# EAGLE design Sensor_Plug_PCB (EAGLE 9.7.0)
Assembly variants: Standart
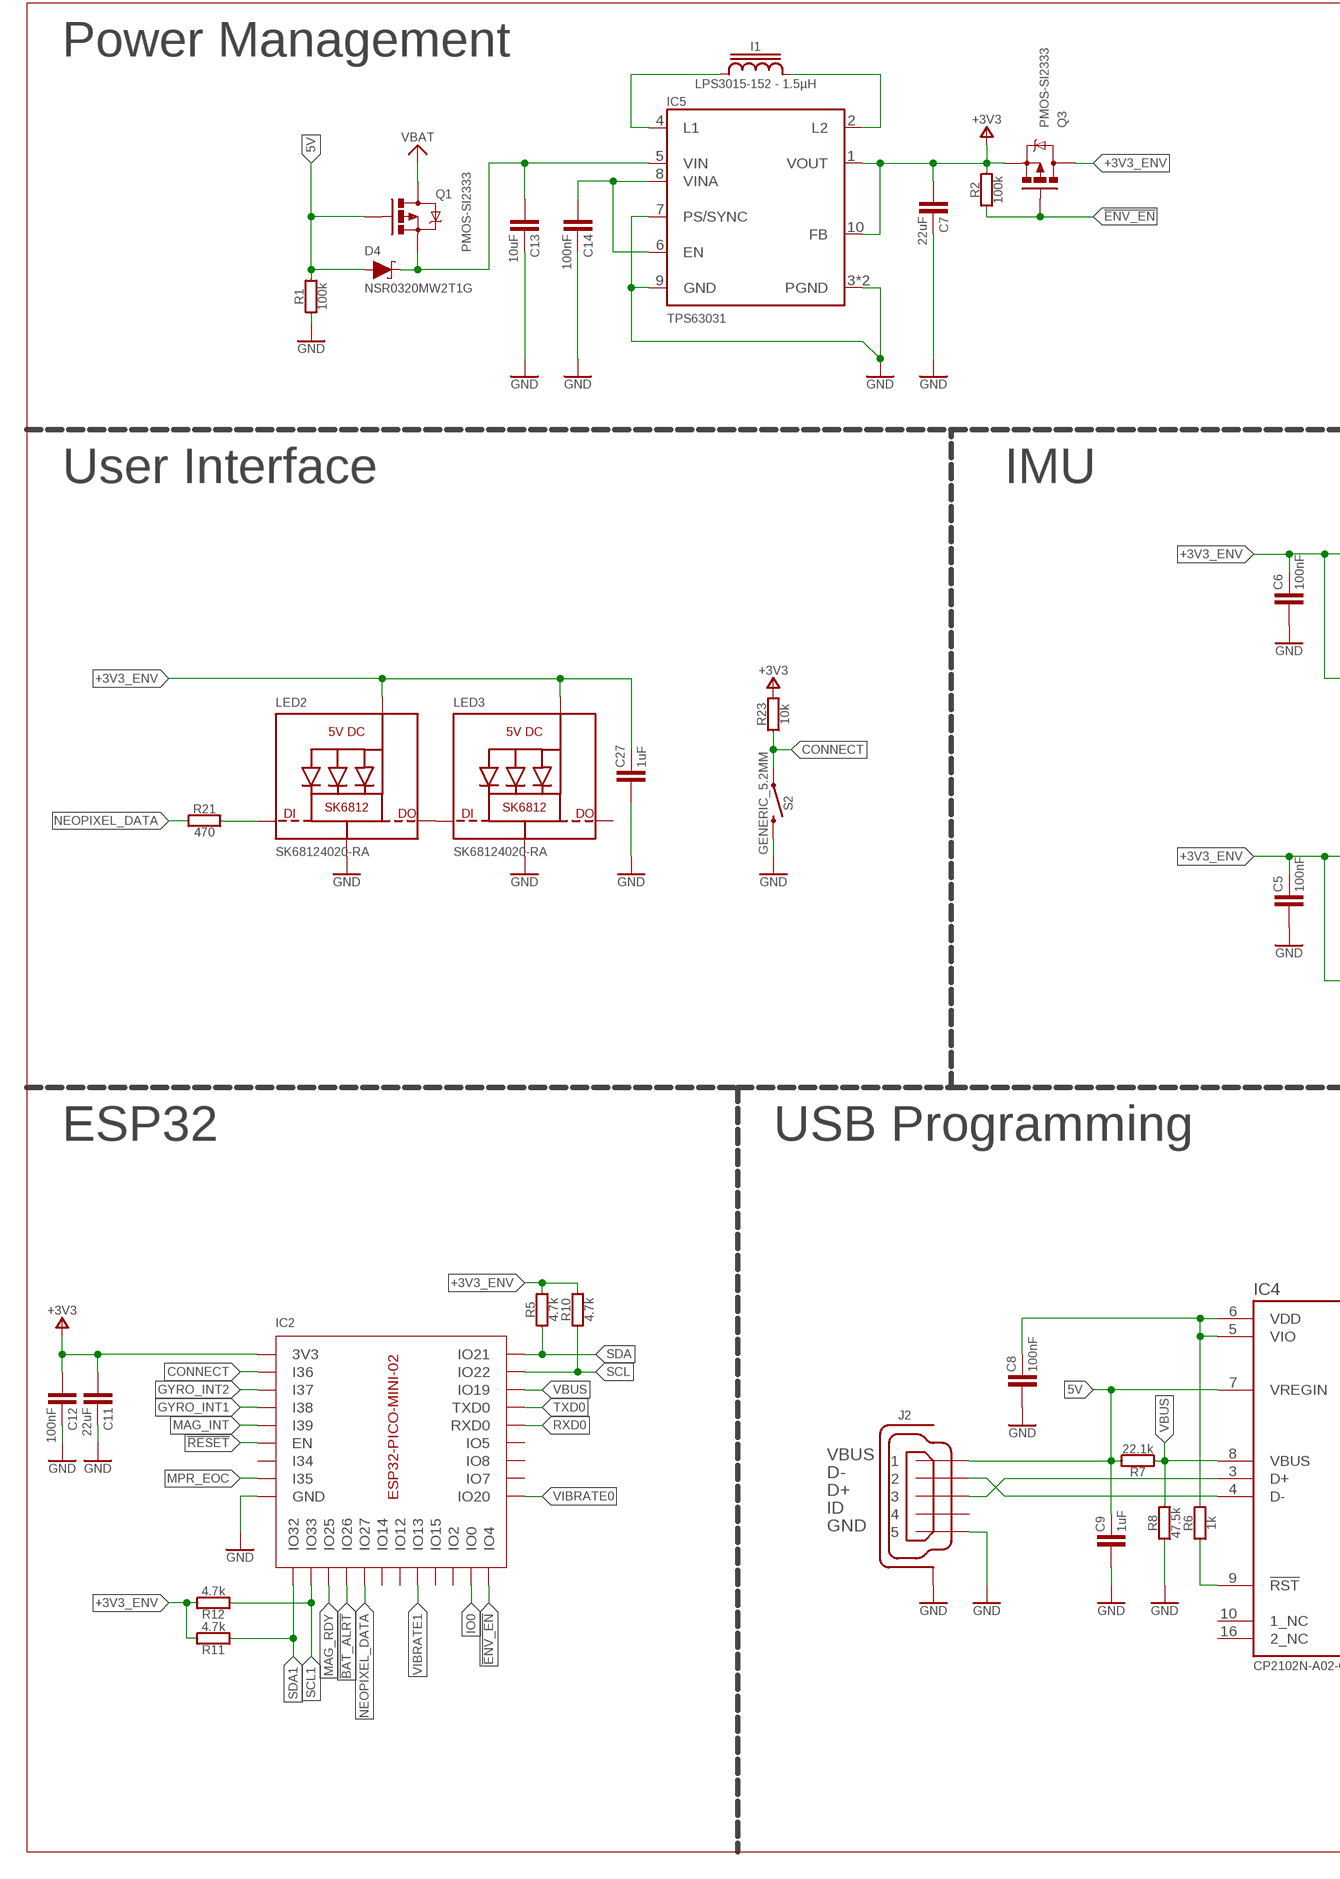
[diagram p0: schematic, sheet 1, part 1 of 2]
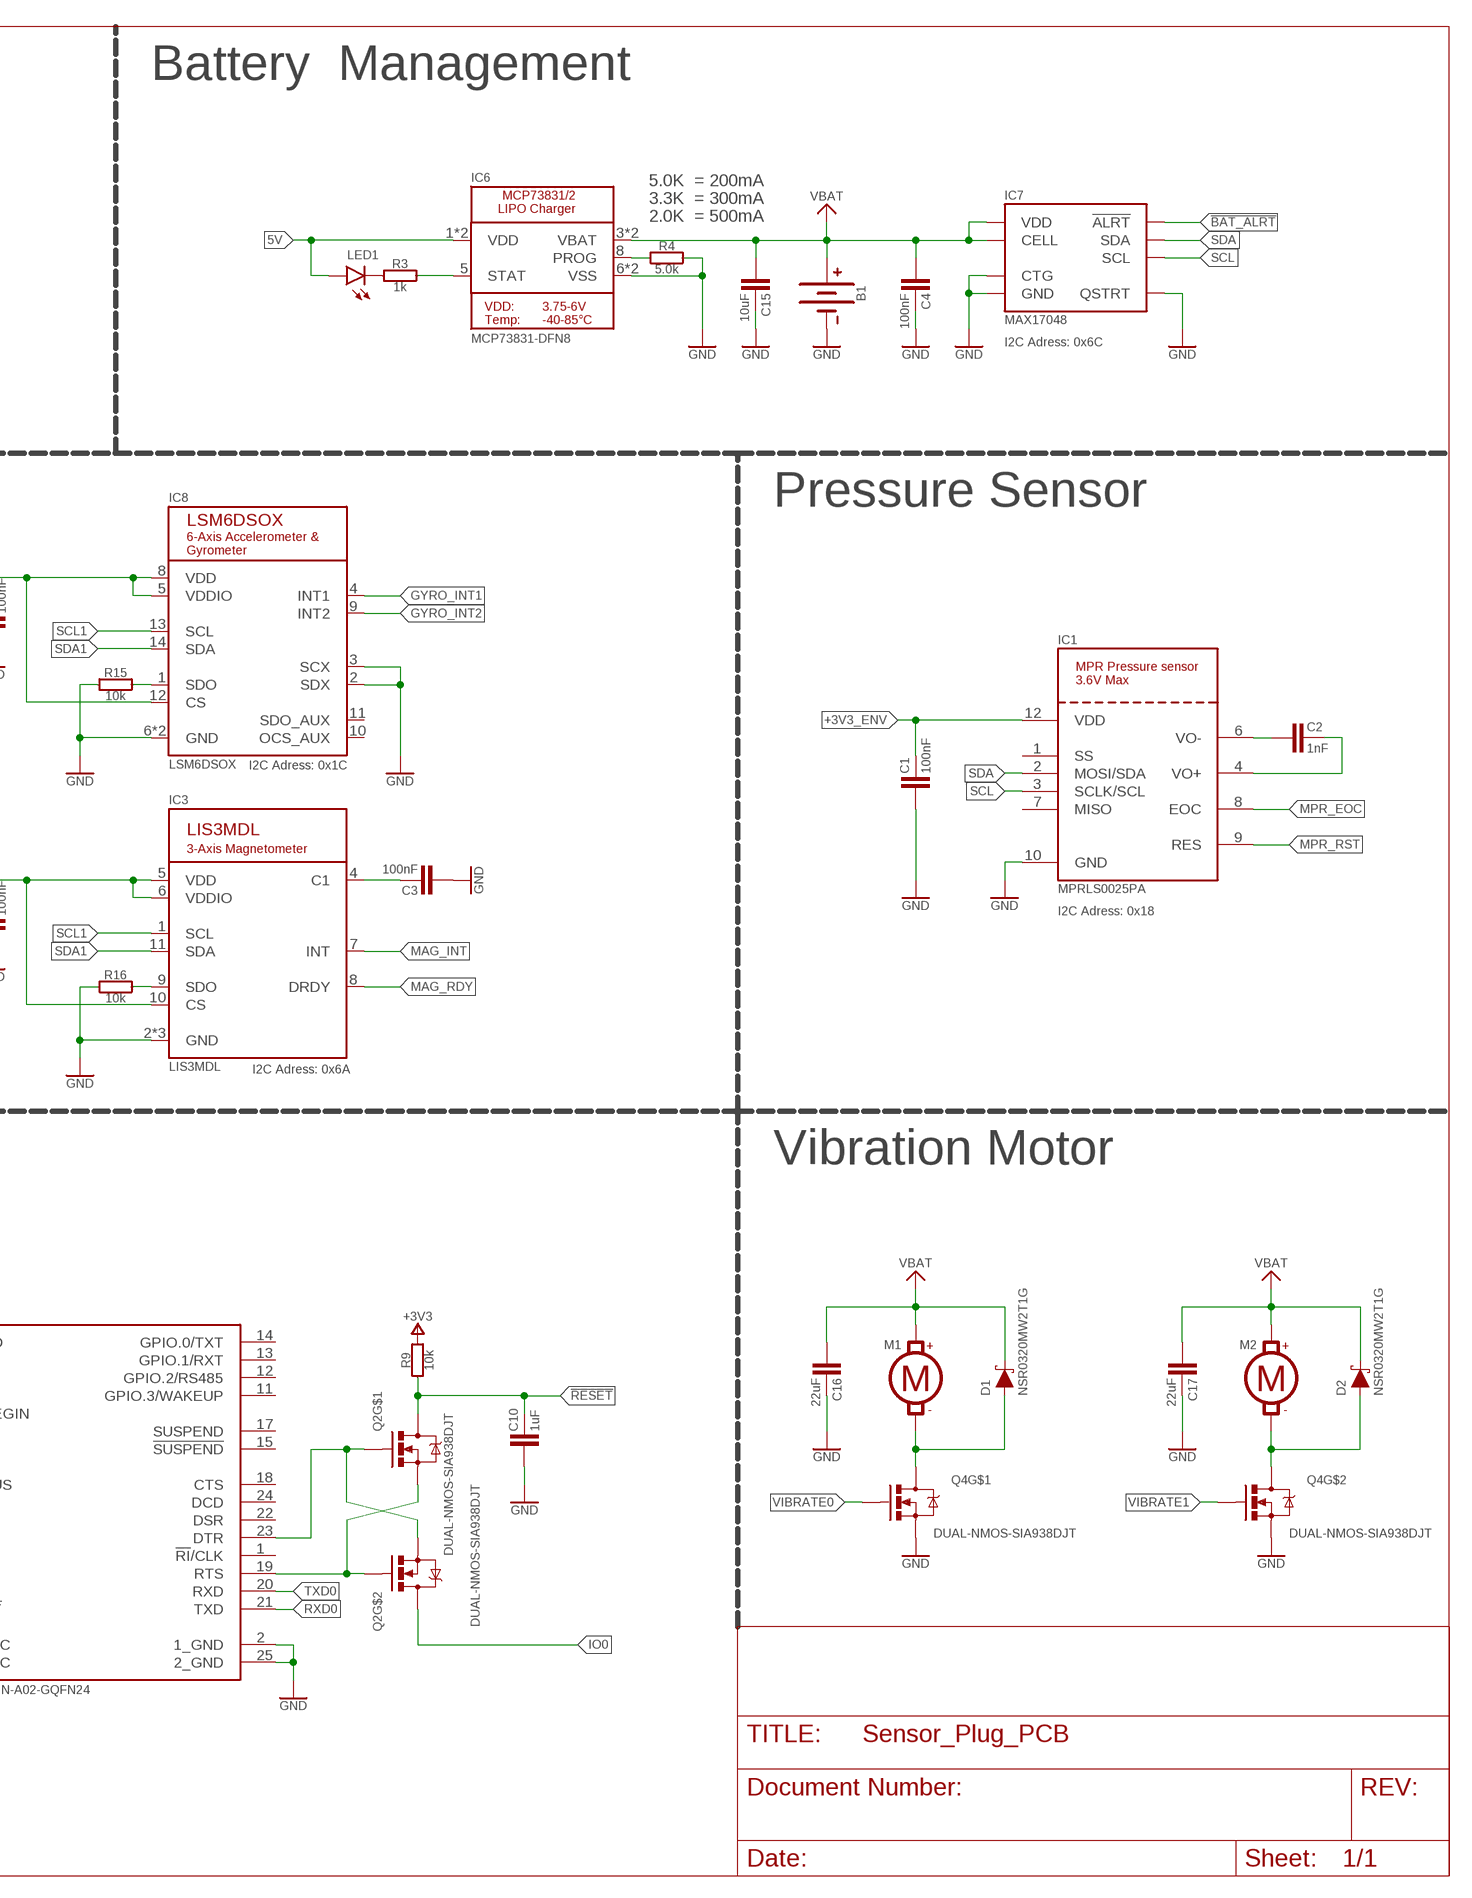
[diagram p1: schematic, sheet 1, part 2 of 2]

## Parts
B1  LIPO-JST_PH_SMDV-02  [JST_PH_SMDV-02]
C1  100nF  C-0603  [C0603]
C2  1nF  C-0603  [C0603]
C3  100nF  C-0603  [C0603]
C4  100nF  C-0603  [C0603]
C5  100nF  C-0603  [C0603]
C6  100nF  C-0603  [C0603]
C7  22uF  C-0805  [C0805]
C8  100nF  C-0603  [C0603]
C9  1uF  C-0603  [C0603]
C10  1uF  C-0603  [C0603]
C11  22uF  C-0805  [C0805]
C12  100nF  C-0603  [C0603]
C13  10uF  C-0805  [C0805]
C14  100nF  C-0603  [C0603]
C15  10uF  C-0805  [C0805]
C16  22uF  C-0805  [C0805]
C17  22uF  C-0805  [C0805]
C27  1uF  C-0603  [C0603]
D1  NSR0320MW2T1G  DIODE-SCHOTTKY-SOD323  [SOD-323]
D2  NSR0320MW2T1G  DIODE-SCHOTTKY-SOD323  [SOD-323]
D4  NSR0320MW2T1G  DIODE-SCHOTTKY-SOD323  [SOD-323]
I1  LPS3015-152 - 1.5µH  I-LPS3015  [LPS3015]
IC1  MPRLS0025PA  [MPRLS0025PA]
IC2  EPS32-PICO-MINI-02  [ESP32-PICO-MINI-02]
IC3  LIS3MDL  [LGA12_2X2MM]
IC4  CP2102N-A02-GQFN24  [QFN24]
IC5  TPS63031  [R-PWSON-N10]
IC6  MCP73831-DFN8  [DFN8_2X3]
IC7  MAX17048  MAX17048/9  [DFN8_2X2]
IC8  LSM6DSOX  [LGA-14L]
J2  -  USB-MICROHIROSE  [ZX62-AB-5PA]
LED1  LED-0603-SIDEVIEW  [LED_0603_SIDEVIEW]
LED2  SK68124020-RA  [SK6812-4020-SIDE]
LED3  SK68124020-RA  [SK6812-4020-SIDE]
M1  MOTOR-PADS  [MOTOR-PADS]
M2  MOTOR-PADS  [MOTOR-PADS]
Q1  PMOS-SI2333  [SOT23-3]
Q2  DUAL-NMOS-SIA938DJT  [POWERPAK_SC70-6L_DUAL]
Q3  PMOS-SI2333  [SOT23-3]
Q4  DUAL-NMOS-SIA938DJT  [POWERPAK_SC70-6L_DUAL]
R1  100k  R-0603  [R0603]
R2  100k  R-0603  [R0603]
R3  1k  R-0603  [R0603]
R4  5.0k  R-0603  [R0603]
R5  4.7k  R-0603  [R0603]
R6  1k  R-0603  [R0603]
R7  22.1k  R-0603  [R0603]
R8  47.5k  R-0603  [R0603]
R9  10k  R-0603  [R0603]
R10  4.7k  R-0603  [R0603]
R11  4.7k  R-0603  [R0603]
R12  4.7k  R-0603  [R0603]
R15  10k  R-0603  [R0603]
R16  10k  R-0603  [R0603]
R21  470  R-0603  [R0603]
R23  10k  R-0603  [R0603]
S2  GENERIC_5.2MM  TACT_SWITCHC&K_KMS221GLFS  [C&K_KMS]

## Nets
5V: C9.1 D4.A IC4.7(VREGIN) IC6.1(VDD) IC6.2(VDD) J2.1 LED1.A Q1.1(G) R1.2 R7.2
!BAT_ALRT: IC2.P$16(IO26) IC7.5(!ALRT)
!ENV_EN: IC2.P$24(IO4) Q3.1(G) R2.1
!RESET: C10.1 IC2.P$8(EN) Q2.6(D) Q2.7(D) R9.1
+3V3: C7.2 C11.2 C12.2 IC2.P$3(3V3) IC5.1(VOUT) IC5.10(FB) Q3.2(S) R2.2 R9.2 R23.2
+3V3_ENV: C1.1 C5.1 C6.1 C27.1 IC1.12(VDD) IC3.5(VDD) IC3.6(VDDIO) IC3.10(CS) IC8.5(VDDIO) IC8.8(VDD) IC8.12(CS) LED2.VDD LED3.VDD Q3.3(D) R5.2 R10.2 R11.2 R12.2
CHARGING: IC6.5(STAT) R3.2
CONNECT: IC2.P$4(I36) R23.1 S2.1 S2.5
DTR: IC4.23(DTR) Q2.2(G) Q2.4(S)
GND: B1.1(-) C1.2 C3.2 C4.1 C5.2 C6.2 C7.1 C8.2 C9.2 C10.2 C11.1 C12.1 C13.1 C14.1 C15.1 C16.1 C17.1 C27.2 IC1.10(GND) IC2.P$1(GND) IC2.P$2(GND) IC2.P$11(GND) IC2.P$14(GND) IC2.P$36(GND) IC2.P$37(GND) IC2.P$38(GND) IC2.P$39(GND) IC2.P$40(GND) IC2.P$41(GND) IC2.P$42(GND) IC2.P$43(GND) IC2.P$44(GND) IC2.P$45(GND) IC2.P$46(GND) IC2.P$47(GND) IC2.P$48(GND) IC2.P$49(GND) IC2.P$50(GND) IC2.P$51(GND) IC2.P$52(GND) IC2.P$53(GND) IC2.P$54(GND) IC2.P$55(GND) IC2.P$56(GND) IC2.P$57(GND) IC2.P$58(GND) IC2.P$59(GND) IC2.P$60(GND) IC2.P$61(GND) IC3.2(GND) IC3.3(GND) IC3.12(GND) IC4.2(1_GND) IC4.25(2_GND) IC5.3(PGND) IC5.7(PS/SYNC) IC5.9(GND) IC5.11(PGND) IC6.6(VSS) IC6.9(VSS) IC7.1(CTG) IC7.4(GND) IC7.6(QSTRT) IC7.9(GND) IC8.2(SDX) IC8.3(SCX) IC8.6(GND) IC8.7(GND) J2.5 J2.6(SH) J2.7(SH) J2.8(SH) J2.9(SH) J2.10(SH) J2.11(SH) LED2.GND LED3.GND Q4.1(S) Q4.4(S) R1.1 R4.2 R8.1 R15.1 R16.1 S2.2 S2.3 S2.4
GYRO_INT1: IC2.P$6(I38) IC8.4(INT1)
GYRO_INT2: IC2.P$5(I37) IC8.9(INT2)
IO0: IC2.P$23(IO0) Q2.3(D) Q2.8(D)
MAG_INT: IC2.P$7(I39) IC3.7(INT)
MAG_RDY: IC2.P$15(IO25) IC3.8(DRDY)
MPR_EOC: IC1.8(EOC) IC2.P$10(I35)
MPR_RST: IC1.9(RES)
N$1: C8.1 IC4.5(VIO) IC4.6(VDD) R6.2
N$3: C2.2 IC1.6(VO-)
N$4: C2.1 IC1.4(VO+)
N$5: C3.1 IC3.4(C1)
N$7: C14.2 IC5.6(EN) IC5.8(VINA)
N$8: I1.1 IC5.4(L1)
N$9: I1.2 IC5.2(L2)
N$10: IC4.4(D-) J2.2
N$11: IC4.3(D+) J2.3
N$12: LED1.C R3.1
N$13: D1.A M1.N Q4.6(D) Q4.7(D)
N$14: IC4.9(!RST!) R6.1
N$15: IC6.8(PROG) R4.1
N$16: LED2.DOUT(DO) LED3.DIN(DI)
N$20: D2.A M2.N Q4.3(D) Q4.8(D)
N$23: IC8.1(SDO) R15.2
N$24: IC3.9(SDO) R16.2
N$26: LED2.DIN(DI) R21.1
NEOPIXEL_DATA: IC2.P$17(IO27) R21.2
RTS: IC4.19(RTS) Q2.1(S) Q2.5(G)
RXD0: IC2.P$30(RXD0) IC4.21(TXD)
SCL: IC1.3(SCLK/SCL) IC2.P$34(IO22) IC7.7(SCL) R10.1
SCL1: IC2.P$13(IO33) IC3.1(SCL) IC8.13(SCL) R12.1
SDA: IC1.2(MOSI/SDA) IC2.P$35(IO21) IC7.8(SDA) R5.1
SDA1: IC2.P$12(IO32) IC3.11(SDA) IC8.14(SDA) R11.1
TXD0: IC2.P$31(TXD0) IC4.20(RXD)
VBAT: B1.2(+) C4.2 C15.2 C16.2 C17.2 D1.C D2.C IC6.3(VBAT) IC6.4(VBAT) IC7.2(CELL) IC7.3(VDD) M1.P M2.P Q1.3(D)
VBUS: IC2.P$33(IO19) IC4.8(VBUS) R7.1 R8.2
VIBRATE0: IC2.P$26(IO20) Q4.2(G)
VIBRATE1: IC2.P$20(IO13) Q4.5(G)
VIN: C13.2 D4.C IC5.5(VIN) Q1.2(S)
Unconnected: IC1.1(SS) IC1.7(MISO) IC2.P$9(I34) IC2.P$18(IO14) IC2.P$19(IO12) IC2.P$21(IO15) IC2.P$22(IO2) IC2.P$27(IO7) IC2.P$28(IO8) IC2.P$29(IO5) IC4.1(!RI!/CLK) IC4.10(1_NC) IC4.11(GPIO.3/WAKEUP) IC4.12(GPIO.2/RS485) IC4.13(GPIO.1/RXT) IC4.14(GPIO.0/TXT) IC4.15(!SUSPEND!) IC4.16(2_NC) IC4.17(SUSPEND) IC4.18(CTS) IC4.22(DSR) IC4.24(DCD) IC8.10(OCS_AUX) IC8.11(SDO_AUX) J2.4 LED3.DOUT(DO)

## Notes on the sheet
- Power Management | Battery  Management
- 5.0K  = 200mA
- 3.3K  = 300mA
- 2.0K  = 500mA
- I2C Adress: 0x6C
- User Interface | IMU | Pressure Sensor
- I2C Adress: 0x1C
- I2C Adress: 0x18
- I2C Adress: 0x6A
- ESP32 | USB Programming | Vibration Motor

## Library data of the parts
B1 = Std Parts Library:LIPO
C1-C17 C27 = Std Parts Library:C
D1 D2 D4 = Std Parts Library:DIODE-SCHOTTKY
I1 = Std Parts Library:I
IC1 = Std Parts Library:MPRLS0025PA: I2C piezoresistive silicon pressure sensor; MPN: MPRLS0025PA00001A
IC2 = Std Parts Library:EPS32-PICO-MINI-02: https://www.espressif.com/sites/default/files/documentation/esp32-pico-mini-02_datasheet_en.pdf
IC3 = Std Parts Library:LIS3MDL: Digital output magnetic sensor. ultra-low-power, high-performance 3-axis magnetometer
IC4 = Std Parts Library:CP2102N-A02-GQFN24; MPN: CP2102N-A02-GQFN24
IC5 = Std Parts Library:TPS63031: TPS6303x High Efficiency Single Inductor Buck-Boost Converter With 1-A Switches The TPS6303x devices provide a power supply solution for products powered by either a two-cell or three-cell alkaline, NiCd or NiMH battery, or a one-cell Li-ion or Li-polymer battery. Output currents can go as high as 600 mA while using a single-cell Li-ion or Li-polymer battery, and discharge it down to 2.5 V or lower. The buck-boost converter is based on a fixed frequency, pulse width modulation (PWM) controller using synchronous rectification to obtain maximum efficiency. At low load currents, the converter enters power-save mode to maintain high efficiency over a wide load current range. The power-save mode can be disabled, forcing the converter to operate at a fixed switching frequency. The maximum average current in the switches is limited to a typical value of 1000 mA. The output voltage is programmable using an external resistor divider, or is fixed internally on the chip. The converter can be disabled to minimize battery drain. During shutdown, the load is disconnected from the battery. The TPS6303x devices operate over a free air temperature range of –40°C to 85°C. The devices are packaged in a 10-pin VSON package measuring 2.5 mm × 2.5 mm (DSK).
IC6 = Std Parts Library:MCP73831
IC7 = Std Parts Library:MAX17048/9
IC8 = Std Parts Library:LSM6DSOX
J2 = Std Parts Library:USB-MICRO: USB - micro AB USB 2.0 Receptacle Connector 5 Position Surface Mount, Right Angle, Horizontal; MPN: ZX62-AB-5PA(31)
LED1 = Std Parts Library:LED
LED2 LED3 = Std Parts Library:SK6812; MPN: SK6812 SIDE-A
M1 M2 = Std Parts Library:MOTOR
Q1 Q3 = Std Parts Library:PMOS; MPN: SI2333DDS-T1-GE3
Q2 Q4 = Std Parts Library:DUAL-NMOS
R1-R12 R15 R16 R21 R23 = Std Parts Library:R
S2 = Std Parts Library:TACT_SWITCH

## Board
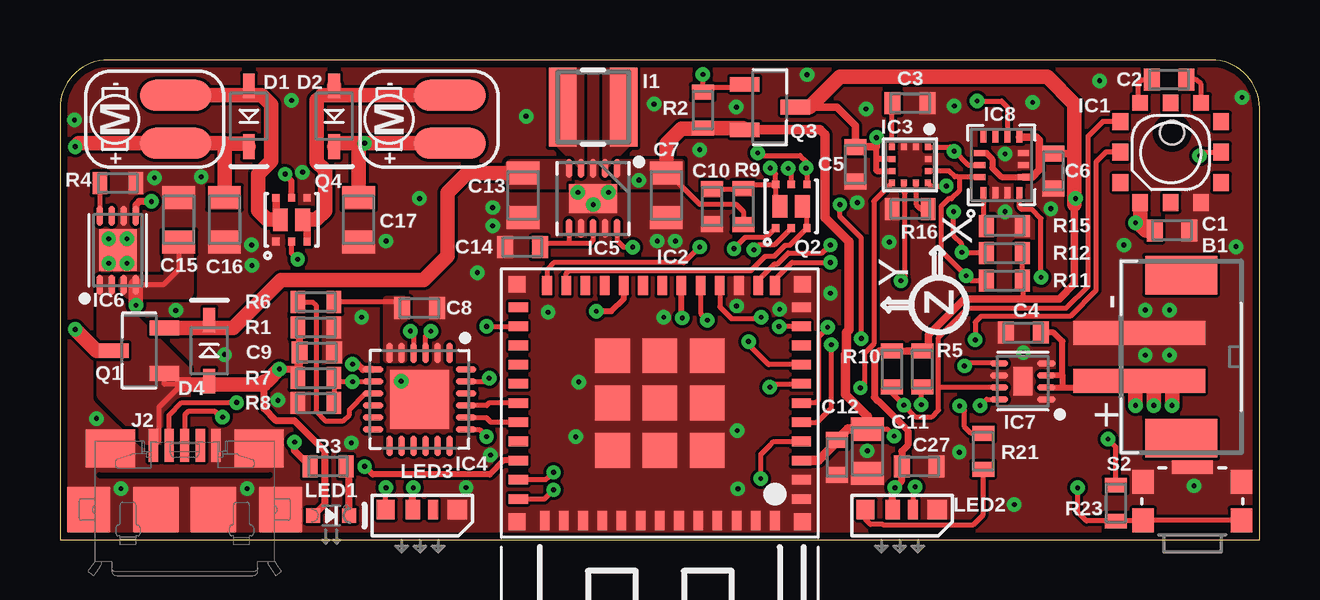
[diagram p2: board, top side]
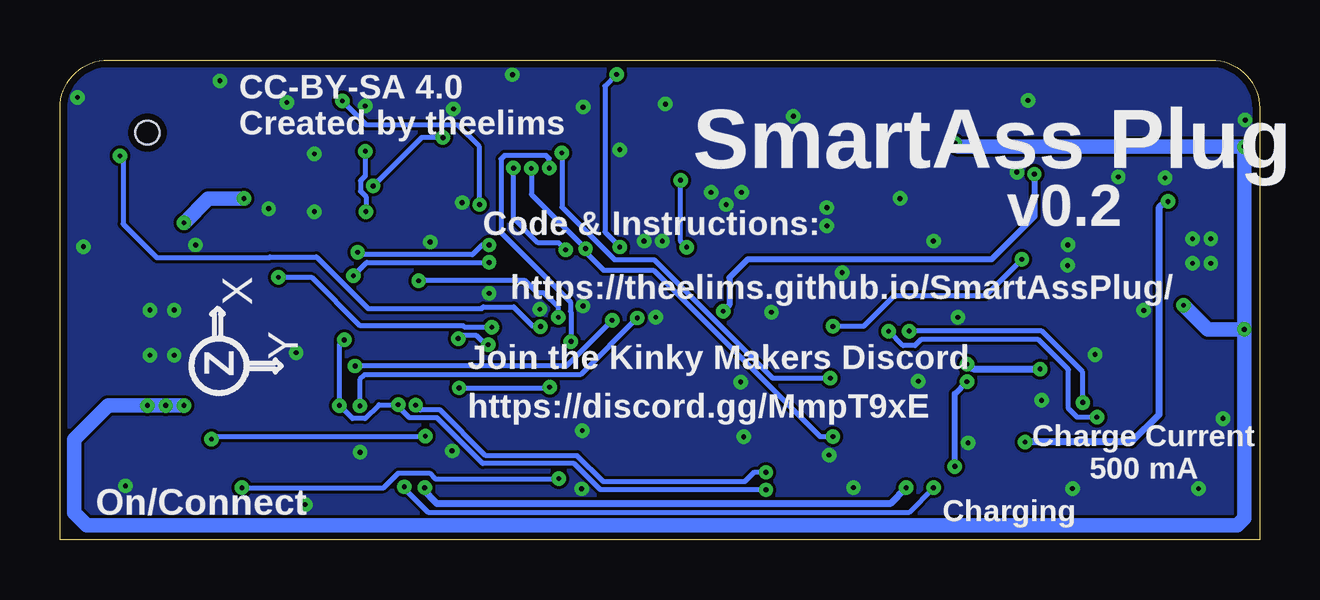
[diagram p3: board, bottom side, seen from below]

Size 50 x 20 mm. Coordinates in mm from the lower left corner, seen from the top.
Outline: 0,0 50,0 50,18 arc90 48,20 2,20 arc90 0,18 0,0
Copper layers (1*16): Top 0.035mm / dielectric 1.5mm / Bottom 0.035mm
Design rules "aisler_2_layer_complex": minimum track width 0.125mm, minimum drill 0.2mm, track to track 0.125mm, track to pad 0.125mm, pad to pad 0.125mm, via to via 0.125mm, smd to smd 0.125mm, copper to edge 0.3mm, drill to drill 0.25mm, minimum pad ring 0.2mm, minimum via ring 0.2mm, stop-mask expansion 0mil, vias tented up to drill 0mil, thermal gap 10mil

### Footprints (pad centres in the part's own frame; a part is rotated, then mirrored left to right if it is on the bottom)
JST_PH_SMDV-02 = smd 1 x 5.5: 1 -1,-1.75; 2 1,-1.75 | smd 1.6 x 3: NC1 -3.4,0; NC2 3.4,0
C0603 = smd 0.667 x 0.917: 1 -0.725,0; 2 0.725,0
C0805 = smd 0.967 x 1.367: 1 -0.925,0; 2 0.925,0
SOD-323 = smd 1.032 x 0.491: A 1.268,0; C -1.268,0
LPS3015 = smd 1.14 x 3.3: 1 -1.27,0; 2 1.27,0
MPRLS0025PA = smd 0.7 x 0.65: 1 -1.27,2.159; 2 0,2.159; 3 1.27,2.159; 5 2.05,0.059; 7 1.27,-2.041; 8 0,-2.041; 9 -1.27,-2.041; 10 -2.1,-1.211; 11 -2.1,0.059; 12 -2.1,1.329 | smd 0.65 x 0.65: 4 2.05,1.329; 6 2.05,-1.211 | hole 1: 0.81,0.009
ESP32-PICO-MINI-02 = smd 0.8 x 0.4: P$1 -5.9,4; P$2 -5.9,3.2; P$3 -5.9,2.4; P$4 -5.9,1.6; P$5 -5.9,0.8; P$6 -5.9,0; P$7 -5.9,-0.8; P$8 -5.9,-1.6; P$9 -5.9,-2.4; P$10 -5.9,-3.2; P$11 -5.9,-4; P$25 5.9,-4; P$26 5.9,-3.2; P$27 5.9,-2.4; P$28 5.9,-1.6; P$29 5.9,-0.8; P$30 5.9,0; P$31 5.9,0.8; P$32 5.9,1.6; P$33 5.9,2.4; P$34 5.9,3.2; P$35 5.9,4 | smd 0.4 x 0.8: P$12 -4.8,-4.9; P$13 -4.1,-4.9; P$14 -3.3,-4.9; P$15 -2.5,-4.9; P$16 -1.7,-4.9; P$17 -0.9,-4.9; P$18 -0.1,-4.9; P$19 0.7,-4.9; P$20 1.5,-4.9; P$21 2.3,-4.9; P$22 3.1,-4.9; P$23 3.9,-4.9; P$24 4.7,-4.9; P$36 4.8,4.9; P$37 4,4.9; P$38 3.2,4.9; P$39 2.4,4.9; P$40 1.6,4.9; P$41 0.8,4.9; P$42 0,4.9; P$43 -0.8,4.9; P$44 -1.6,4.9; P$45 -2.4,4.9; P$46 -3.2,4.9; P$47 -4,4.9; P$48 -4.8,4.9 | smd 1.45 x 1.45: P$49 0,0; P$54 -1.975,1.975; P$55 0,1.975; P$56 1.975,1.975; P$57 1.975,0; P$58 1.975,-1.975; P$59 0,-1.975; P$60 -1.975,-1.975; P$61 -1.975,0 | smd 0.7 x 0.7: P$50 5.95,4.95; P$51 5.95,-4.95; P$52 -5.95,-4.95; P$53 -5.95,4.95
LGA12_2X2MM = smd 0.275 x 0.25: 1 -0.75,0.75; 2 -0.75,0.25; 3 -0.75,-0.25; 4 -0.75,-0.75; 7 0.75,-0.75; 8 0.75,-0.25; 9 0.75,0.25; 10 0.75,0.75 | smd 0.25 x 0.275: 5 -0.25,-0.75; 6 0.25,-0.75; 11 0.25,0.75; 12 -0.25,0.75
QFN24 = smd 0.862 x 0.274: 1 -1.935,1.25; 2 -1.935,0.75; 3 -1.935,0.25; 4 -1.935,-0.25; 5 -1.935,-0.75; 6 -1.935,-1.25; 13 1.935,-1.25; 14 1.935,-0.75; 15 1.935,-0.25; 16 1.935,0.25; 17 1.935,0.75; 18 1.935,1.25 | smd 0.274 x 0.862: 7 -1.25,-1.935; 8 -0.75,-1.935; 9 -0.25,-1.935; 10 0.25,-1.935; 11 0.75,-1.935; 12 1.25,-1.935; 19 1.25,1.935; 20 0.75,1.935; 21 0.25,1.935; 22 -0.25,1.935; 23 -0.75,1.935; 24 -1.25,1.935 | smd 2.45 x 2.45: 25 0,0
R-PWSON-N10 = smd 0.8 x 0.28: 1 -1.25,1; 2 -1.25,0.5; 3 -1.25,0; 4 -1.25,-0.5; 5 -1.25,-1; 6 1.25,-1; 7 1.25,-0.5; 8 1.25,0; 9 1.25,0.5; 10 1.25,1 | smd 1.2 x 2: 11 0,0
DFN8_2X3 = smd 0.841 x 0.274: 1 -1.438,0.75; 2 -1.438,0.25; 3 -1.438,-0.25; 4 -1.438,-0.75; 5 1.438,-0.75; 6 1.438,-0.25; 7 1.438,0.25; 8 1.438,0.75 | smd 1.75 x 1.55: 9 0,0
DFN8_2X2 = smd 0.762 x 0.274: 1 -0.985,0.75; 2 -0.985,0.25; 3 -0.985,-0.25; 4 -0.985,-0.75; 5 0.985,-0.75; 6 0.985,-0.25; 7 0.985,0.25; 8 0.985,0.75 | smd 0.8 x 1.2: 9 0,0
LGA-14L = smd 0.475 x 0.25: 1 -1.163,0.75; 2 -1.163,0.25; 3 -1.163,-0.25; 4 -1.163,-0.75; 8 1.163,-0.75; 9 1.163,-0.25; 10 1.163,0.25; 11 1.163,0.75 | smd 0.25 x 0.475: 5 -0.5,-0.912; 6 0,-0.912; 7 0.5,-0.912; 12 0.5,0.912; 13 0,0.912; 14 -0.5,0.912
ZX62-AB-5PA = smd 0.4 x 1.35: 1 -1.3,3.025; 2 -0.65,3.025; 3 0,3.025; 4 0.65,3.025; 5 1.3,3.025 | smd 2.1 x 1.6: 6 3.1,2.9; 11 -3.1,2.9 | smd 1.8 x 1.9: 7 4,0.35; 10 -4,0.35 | smd 1.9 x 1.9: 8 1.2,0.35; 9 -1.2,0.35
LED_0603_SIDEVIEW = smd 0.6 x 0.6: A 0,-0.75; C 0,0.75
SK6812-4020-SIDE = smd 0.75 x 0.8: DIN -1.425,0 | smd 0.4 x 0.8: DOUT 0.55,0 | smd 0.8 x 0.8: GND 1.56,0 | smd 0.6 x 0.8: VDD -0.3,0
MOTOR-PADS = smd 3 x 1.3: N 0,-1; P 0,1
SOT23-3 = smd 1.219 x 0.612: 1 -1.052,0.95; 2 -1.052,-0.95; 3 1.052,0
POWERPAK_SC70-6L_DUAL = smd 0.3 x 0.325: 1 -0.65,-0.912; 2 0,-0.912; 3 0.65,-0.912; 4 0.65,0.912; 5 0,0.912; 6 -0.65,0.912 | smd 0.613 x 0.95: 7 -0.467,0; 8 0.467,0
R0603 = smd 0.617 x 0.917: 1 -0.75,0; 2 0.75,0
C&K_KMS = smd 0.9 x 1: 1 -2.05,-0.8; 2 -2.05,0.8; 4 2.05,0.8; 5 2.05,-0.8 | smd 1.7 x 0.55: 3 0,1.425

### Placement (x,y rotation side)
B1  46.74,7.62 270 top
C1  46.35,12.9 0 top
C2  46.23,19.18 0 top
C3  35.43,18.2 0 top
C4  40.15,8.63 0 top
C5  33.15,15.64 270 top
C6  41.4,15.37 270 top
C7  25.27,14.35 90 top
C8  14.99,9.65 0 top
C9  10.71,7.8 0 top
C10  27.18,13.89 270 top
C11  33.66,3.68 90 top
C12  32.38,3.43 90 top
C13  19.3,14.35 90 top
C14  19.28,12.19 0 top
C15  4.95,13.34 270 top
C16  6.86,13.34 90 top
C17  12.45,13.34 90 top
C27  35.81,3.05 0 top
D1  7.87,17.65 90 top
D2  11.43,17.65 90 top
D4  6.22,7.87 270 top
I1  22.23,18.03 0 top
IC1  46.35,16.16 90 top
IC2  25,5.69 180 top
IC3  35.43,15.62 270 top
IC4  14.99,5.84 270 top
IC5  22.23,14.22 270 top
IC6  2.41,12.06 90 top
IC7  40.13,6.6 180 top
IC8  39.24,15.62 90 top
J2  5.2,0.9 0 top
LED1  11.3,1 270 top
LED2  35,1.25 0 top
LED3  15,1.25 0 top
M1  4.83,17.53 180 top
M2  16.26,17.53 180 top
Q1  3.3,7.87 180 top
Q2  30.48,13.9 0 top
Q3  29.59,18.03 0 top
Q4  9.65,13.34 0 top
R1  10.67,8.84 180 top
R2  26.8,17.91 270 top
R3  11.18,3.05 180 top
R4  2.41,14.86 0 top
R5  35.94,7.11 90 top
R6  10.67,9.91 0 top
R7  10.67,6.73 180 top
R8  10.67,5.69 0 top
R9  28.49,13.89 270 top
R10  34.67,7.11 90 top
R11  39.37,10.79 0 top
R12  39.37,11.94 0 top
R15  39.37,13.08 180 top
R16  35.44,13.78 0 top
R21  38.48,3.68 90 top
R23  44.01,1.52 90 top
S2  47.2,1.6 0 top

### Tracks (layer width: path | path; a pad name or v marks a point on that pad's centre or on a via)
5V  (via drill 0.2)
  Top 0.2: J2.1 4.12,4.15 4.12,5.52 5.08,6.48 | Q1.1 4.35,6.48 6.22,6.48 | 6.22,6.48 6.35,6.48 | D4.A 6.22,6.48
  Top 0.3: v9.14,7.11 9.91,7.11 9.98,7.19 C9.1 | R7.2 9.92,7.73 C9.1 | R1.2 9.98,8.78 C9.1 | LED1.A 11.05,1.5 11.05,3.68 9.78,4.95 9.02,4.95 8.51,5.46 8.51,6.48 8.51,6.6 | IC4.7 12.63,7.09 12.41,7.31 v12.19,7.31
  Top 0.6: v9.14,7.11 8.64,6.6 8.51,6.6 | 5.08,6.48 6.35,6.48 8.51,6.48
  Bottom 0.3: v12.19,7.31 12.04,7.16 11.95,7.16 11.9,7.11 v9.14,7.11
  pour Top (rank 2, no thermals): 5.16,4.24 5.16,6.99 2.17,9.98 2.13,10.04 2.11,10.12 2.11,10.75 1.82,10.75 1.82,6.06 3.65,4.24
!BAT_ALRT  (via drill 0.2)
  Top 0.2: IC2.P$16 26.7,9.43 v26.99,9.14 | IC7.5 39.13,7.37 37.83,7.37 v37.7,7.24
  Bottom 0.2: v26.99,9.14 28.89,7.24 v37.7,7.24
!ENV_EN  (via drill 0.2)
  Top 0.2: Q3.1 28.41,18.86 27,18.86 R2.1 v26.8,19.4 | IC2.P$24 20.3,11.26 20.58,11.54 26.01,11.54 v26.66,12.2
  Bottom 0.2: v26.8,19.4 27.29,18.91 27.29,12.82 v26.66,12.2
!RESET  (via drill 0.2)
  Top 0.2: C10.1 28.46,14.62 R9.1 28.66,14.81 Q2.6 | Q2.7 29.83,14.08 Q2.6 | IC2.P$8 29.54,7.29 28.7,8.13 v28.7,8.26 | Q2.6 29.83,15.26 29.61,15.48 v29.61,15.49
  Bottom 0.2: v29.61,15.49 29.61,15.89 29.73,16.02 31.48,16.02 31.62,15.88 31.62,12.81 28.73,9.91 28.73,9.52 28.7,9.5 v28.7,8.26
+3V3  (via drill 0.2)
  Top 0.2: IC5.10 23.23,12.46 23.5,12.19 v23.88,12.19 | R23.2 44.01,3.87 v43.69,4.19 | C11.2 34.47,4.61 v34.77,4.31 | R9.2 28.49,13.68 28.19,13.97 26.67,13.97 25.36,15.28 C7.2
  Top 0.4: IC2.P$3 31.61,3.29 32.38,4.06 C12.2 32.84,4.61 C11.2 33.66,5.14 32.74,6.06 32.74,7.72 32.78,7.76 32.78,8.64 32.88,8.75 32.88,12.43 31.89,13.43 31.89,16.88 31.68,17.08 Q3.2
  Top 0.6: C7.2 25.27,16.51 25.91,17.14 26.79,17.14 R2.2 28.47,17.16 Q3.2
  Bottom 0.2: v23.88,12.19 24.13,12.45 v24.13,14.99 | v43.69,4.19 43.57,4.31 v34.77,4.31
  pour Top (rank 2, no thermals): 23.27,14.76 25.88,14.76 25.88,15.72 23.27,15.72
+3V3_ENV  (via drill 0.2)
  Top 0.2: v42.33,14.22 42.29,14.19 42.29,13.97 | 40.13,10.03 40.13,10.78 R11.2 R12.2 | 33.16,16.38 C5.1 | IC3.10 36.31,14.74 v36.95,14.74
  Top 0.254: IC8.12 38.62,16.12 38.86,15.88 38.86,15.49 39.23,15.12 IC8.5 | IC3.6 34.04,15.37 34.04,15.88 | IC3.5 34.04,15.87 34.04,15.88 | 34.04,15.88 v34.04,16.76
  Top 0.3: LED3.VDD 14.7,2.13 v14.73,2.16 | 36.2,7.86 35.31,7.86 R10.2 | LED2.VDD 34.7,2.06 v34.8,2.16 35.09,2.45 C27.1 35.09,3.68 35.34,3.94 35.34,4.55 34.11,5.78 34.1,5.78 33.94,5.94 33.94,7.64
  Top 0.305: 35.31,7.86 R5.2 | R10.2 34.16,7.86 33.94,7.64 | 31.24,18.03 32.38,18.03 33.15,17.27 C5.1 | 42.29,14.19 42.29,10.67 41.66,10.03 40.13,10.03 37.69,10.03 36.2,8.54 36.2,7.86 | v34.04,16.76 34.04,16.38 33.16,16.38 | 42.29,16.09 C6.1 40.83,16.09 | IC8.5 40.52,15.12 40.83,15.43 40.83,16.09 | 40.83,16.09 40.83,16.66 40.7,16.78 IC8.8
  Top 0.6: 42.29,13.97 42.29,14.19 42.29,16.09 42.29,18.16 41.15,19.3 32.51,19.3 31.24,18.03 Q3.3 | 44.96,13.21 45.27,12.9 C1.1 | IC1.12 45.03,13.28 44.96,13.21 | 44.96,13.21 v44.83,13.21
  Bottom 0.2: v34.04,16.76 34.92,16.76 v36.95,14.74
  Bottom 0.3: v14.73,2.16 15.39,1.5 34.29,1.5 34.87,2.08 v34.8,2.16
  Bottom 0.6: v44.83,13.21 43.81,14.22 v42.33,14.22
CHARGING  (via drill 0.2)
  Top 0.3: R3.2 9.78,3.7 v9.78,4.06 | v3.81,14.1 3.3,14.1 3.16,13.96 IC6.5
  Bottom 0.3: v9.78,4.06 5.33,4.06 4.19,5.21 4.19,13.84 3.94,14.1 v3.81,14.1
CONNECT  (via drill 0.2)
  Top 0.2: v42.42,2.16 42.42,1.14 42.79,0.77 R23.1 44.03,0.8 S2.1 S2.5 | v29.21,2.54 29.21,3.56 29.34,3.68 29.61,3.95 29.75,4.09 IC2.P$4
  Bottom 0.2: v42.42,2.16 36.5,2.16 35.89,2.77 34.6,2.77 34.37,2.54 v29.21,2.54
DTR  (via drill 0.2)
  Top 0.2: 31.13,15.49 Q2.4 | 31.13,15.49 31.13,15.73 30.84,16.02 29.19,16.02 v29.08,16.13 | IC4.23 17.75,6.59 v17.89,6.73 | 31.13,15.49 v31.1,15.49 | v28.92,12.08 29.12,12.28 29.77,12.28 Q2.2
  Bottom 0.2: v31.1,15.49 31.1,13.4 30.06,12.37 29.21,12.37 v28.92,12.08 | v17.89,6.73 20.3,6.73 25.24,11.67 26.89,11.67 29.08,13.86 v29.08,16.13
GND  (via drill 0.2)
  other vias: 19.43,17.65 8,11.43 24.89,12.45 25.65,12.45 21.59,14.48 22.86,14.48 22.23,13.97 18.03,13.84 12.57,9.27 6.86,7.71 2.54,2.13 7.8,2.13 1.52,5.05 4.83,9.56 5.88,15.13 0.6,17.49 21.5,4.28 21.63,6.57 28.23,4.54 20.35,9.48 31.14,19.39 43.33,19.13 37.49,3.64 47.27,2.24 41.3,13.8 40.54,18.23 45.24,7.68 46.25,7.68 39.78,1.46 9.65,18.31 49.27,18.44 49.02,12.21 33.65,3.7 9.08,5.81 2.79,12.54 2.79,11.52 2.03,11.52 2.03,12.54 14.22,6.6 13.59,12.45 3.94,15.08 7.98,12.29 24.77,18.16 18.03,13.08 14.99,14.22 26.67,16.26 28.19,18.03 10.11,15.32 30,9.61 37.28,18.08 44.35,12.28 45.24,9.57 46.25,9.57 17.4,11.13 25.17,9.27 12.15,4.03 17.94,3.52 16.93,2.16 40.16,7.79 28.2,9.74 39.4,16.08 33.6,17.96 32.11,10.27 28.26,2.12 34.57,12.41 39.4,13.67 33.24,14.05
  pour Top (rank 6, no thermals): 0.1,0.1 50.7,0.1 50.7,20.22 0.1,20.22
  pour Bottom (rank 6, no thermals): 0.1,0.1 50.7,0.1 50.7,20.22 0.1,20.22
GYRO_INT1  (via drill 0.2)
  Top 0.2: IC2.P$6 30.92,5.71 31.5,5.71 31.63,5.84 31.63,8.47 v32,8.85 | IC8.4 39.99,13.86 40.08,13.76 40.52,13.76 40.89,13.39 v40.89,10.94
  Bottom 0.2: v40.89,10.94 40.88,10.92 39.5,10.92 37.48,8.91 33.18,8.91 33.13,8.85 v32,8.85
GYRO_INT2  (via drill 0.2)
  Top 0.2: IC2.P$5 31.56,4.89 32.15,5.48 v32.15,8.13 | v33.4,8.38 33.4,12.57 32.51,13.46 v32.51,13.97 | v38.23,18.29 39.24,18.29 39.5,18.03 IC8.9
  Bottom 0.2: v33.4,8.38 33.27,8.51 32.64,8.51 32.26,8.13 v32.15,8.13 | v32.51,13.97 32.51,16.38 33.42,17.29 37.23,17.29 v38.23,18.29
IO0
  Top 0.2: Q2.8 31.13,13.72 Q2.3 30.42,12.27 30.23,12.27 29.78,11.82 29.4,11.82 28.8,11.22 21.23,11.22 21.1,11.09 IC2.P$23
MAG_INT  (via drill 0.2)
  Top 0.2: v29.59,6.35 29.73,6.49 IC2.P$7 | v33.36,6.32 33.53,6.49 33.53,7.76 33.93,8.16 33.93,14.11 IC3.7
  Bottom 0.2: v33.36,6.32 29.62,6.32 v29.59,6.35
MAG_RDY  (via drill 0.2)
  Top 0.2: v29.23,9.27 29.17,9.21 27.99,9.21 27.5,9.7 IC2.P$15 | v35.05,10.79 35.22,10.97 35.22,14.46 35.18,14.5 IC3.8
  Bottom 0.2: v29.23,9.27 29.23,9.67 29.84,10.29 30.1,10.29 30.61,10.79 v35.05,10.79
MPR_EOC  (via drill 0.2)
  Top 0.2: v47.5,16 47.65,16.16 IC1.8 | IC2.P$10 29.98,8.89 v29.97,8.88
  Bottom 0.2: v47.5,16 47.37,15.88 47.37,13.16 45.97,11.76 41.28,11.76 41.25,11.79 39.31,11.79 37.15,9.63 32.43,9.63 32.36,9.7 31.09,9.7 30.27,8.89 v29.98,8.89 v29.97,8.88
N$1
  Top 0.2: C8.1 14.01,9.91 R6.2
  pour Top (no thermals): 13.61,7.52 14.33,7.52 14.33,10.01 13.61,10.01
N$3
  Top 0.2: IC1.6 47.57,18.98 47.37,19.18 C2.2
N$4
  Top 0.2: IC1.4 44.96,18.28 44.96,19.05 45.09,19.18 C2.1
N$5
  Top 0.2: IC3.4 34.68,18.17 C3.1
N$7
  Top 0.2: IC5.8 22.23,12.48 22.09,12.35 21.23,12.35 | 21.23,12.35 21.23,12.36 IC5.6 | C14.2 20,12.35 21.23,12.35
N$8
  pour Top (no thermals): 20.85,16.45 21.69,15.61 21.69,19.53 20.85,19.53
N$9
  pour Top (no thermals): 22.76,19.53 22.76,15.61 23.72,16.57 23.72,19.53
N$10  (via drill 0.2)
  Top 0.2: J2.2 4.55,5.18 5.08,5.71 5.43,5.71 v7.37,5.71 | v14.61,8.69 14.74,8.56 IC4.4
  Bottom 0.2: v7.37,5.71 7.37,6.99 9.07,8.69 v14.61,8.69
N$11  (via drill 0.2)
  Top 0.2: J2.3 5.2,5.2 5.33,5.33 6.48,5.33 6.71,5.1 v6.78,5.1 | v15.46,8.69 15.24,8.47 IC4.3
  Bottom 0.2: v6.78,5.1 7.6,5.1 7.97,5.47 7.97,7.09 9.22,8.34 14.11,8.34 14.36,8.09 14.86,8.09 v15.46,8.69
N$12
  Top 0.3: LED1.C 12.05,2.92 R3.1
N$13
  Top 0.2: D1.A 7.87,18.78 7.62,18.53
  Top 0.305: Q4.6 9,13.52 Q4.7
  Top 0.6: M1.N 7.62,18.53 8.4,18.53 8.8,18.12 8.8,15.78 8.26,15.24 8.26,13.72 8.64,13.34 Q4.7
N$14
  Top 0.2: R6.1 10.54,9.91 10.67,9.78 10.67,5.33 11.05,4.95 11.81,4.95 12.06,5.21 12.06,5.41 12.74,6.09 IC4.9
N$15
  Top 0.2: R4.1 IC6.8
N$16  (via drill 0.2)
  Top 0.2: LED3.DIN 13.57,2.15 v13.59,2.16 | v35.65,2.2 35.55,2.1 LED2.DOUT
  Bottom 0.2: v13.59,2.16 14.62,1.12 34.63,1.12 35.65,2.14 v35.65,2.2
N$20
  Top 0.305: Q4.3 10.3,13.15 Q4.8
  Top 0.6: M2.N 13.48,18.53 13.46,18.54 11.43,18.54 | D2.A 11.43,18.54 | 11.43,18.54 10.92,18.54 10.71,18.32 10.71,15.75 11.05,15.4 11.05,13.71 10.68,13.34 Q4.8
N$23
  Top 0.2: R15.2 38.49,13.21 IC8.1
N$24
  Top 0.2: IC3.9 35.68,13.97 35.87,13.78 R16.2
N$26
  Top 0.2: R21.1 38.48,1.04 38.07,0.62 34.31,0.62 34.3,0.64 33.78,0.64 33.58,0.84 LED2.DIN
NEOPIXEL_DATA  (via drill 0.2)
  Top 0.2: R21.2 37.97,4.43 37.7,4.7 37.7,5.37 v37.5,5.57
  Top 0.254: v25.94,9.24 25.9,9.28 IC2.P$17
  Bottom 0.2: v37.5,5.57 37.5,6.68 37.3,6.88 28.3,6.88 v25.94,9.24
RTS  (via drill 0.2)
  Top 0.2: IC4.19 17.48,4.59 v17.78,4.29 | Q2.5 30.48,15.35 v30.35,15.48 | v28.09,12.13 28.57,12.61 29.45,12.61 Q2.1
  Bottom 0.2: v17.78,4.29 18.32,4.29 25.26,11.23 27.35,11.23 28.09,11.98 v28.09,12.13 30.35,14.39 v30.35,15.48
RXD0
  Top 0.2: IC4.21 17.78,5.59 17.88,5.69 IC2.P$30
SCL  (via drill 0.2)
  Top 0.2: IC2.P$34 20.25,2.49 20.36,2.6 20.37,2.6 v20.57,2.8 | R10.1 34.67,6.11 v35.18,5.61 35.69,5.1 36.32,5.1 36.62,5.41 36.62,6.35 | IC1.3 43.46,17.43 42.86,16.83 42.86,15.88 42.85,15.88 42.85,10.57 41.94,9.65 37.85,9.65 36.62,8.43 36.62,6.35 | IC7.7 36.98,6.35 36.97,6.35 36.62,6.35
  Bottom 0.2: v20.57,2.8 21.08,2.8 21.46,2.41 27.35,2.41 28.44,3.5 32.25,3.5 34.16,5.41 34.98,5.41 v35.18,5.61
SCL1  (via drill 0.2)
  Top 0.2: IC3.1 37.1,16.37 v37.27,16.19 37.85,15.62 IC8.13 | R12.1 37.63,11.94 v37.59,11.98 37.59,12.32 37.25,12.66 v37.25,13.67 | IC2.P$13 29.1,10.81 29.79,11.49 29.91,11.49 30.36,11.95 31.76,11.95 31.89,12.08 31.91,12.08 v32.11,12.28
  Bottom 0.2: v37.59,11.98 37.5,11.88 32.8,11.88 32.4,12.28 v32.11,12.28 | v37.27,16.19 37.27,15.16 37.47,14.96 37.47,14.52 37.25,14.3 v37.25,13.67
SDA  (via drill 0.2)
  Top 0.2: IC2.P$35 20.19,1.69 v20.57,2.08 | v38.35,5.59 38.62,5.85 IC7.8 | IC1.2 43.6,16.16 43.18,15.74 43.18,10.39 42.1,9.31 38.4,9.31 38.15,9.07 v38.15,8.33 | v35.9,5.62 35.9,6.33 R5.1
  Bottom 0.2: v20.57,2.08 27.48,2.08 28.57,3.17 32.38,3.17 34.29,5.08 35.43,5.08 35.9,5.55 v35.9,5.62 36.71,5.62 37.28,5.05 37.81,5.05 v38.35,5.59 38.35,8.13 v38.15,8.33
SDA1  (via drill 0.2)
  Top 0.2: IC2.P$12 29.8,10.85 30.51,11.56 v32.11,11.56 | R11.1 37.97,10.79 v37.77,11 36.72,12.04 36.72,13.89 37.05,14.22 37.16,14.22 37.48,14.53 37.48,15.08 37.43,15.13 | IC8.14 37.43,15.13 | 37.43,15.13 37.3,15.13 37.06,15.37 IC3.11
  Bottom 0.2: v37.77,11 37.21,11.56 v32.11,11.56
TXD0
  Top 0.2: IC4.20 16.93,5.08 17.78,5.08 17.97,4.89 IC2.P$31
VBAT  (via drill 0.2)
  Top 0.2: C15.2 4.95,11.27 4.31,10.63 IC6.4
  Top 0.254: C4.2 41.42,8.63 41.78,8.26 41.78,6.86 | 41.78,6.86 41.78,6.35 | IC7.3 41.78,6.86 | IC7.2 41.78,6.35 | 41.78,6.35 43.18,6.35 44.99,6.35 B1.2
  Top 0.6: v0.64,8.76 1.52,7.87 Q1.3 | IC6.4 v3.16,9.77 | v0.64,16.38 0.78,16.53 M1.P 6.86,16.53 6.86,16.51 | D2.C 11.57,16.53 v12.7,16.53 | v12.7,16.53 M2.P | v12.7,16.53 12.45,16.53 C17.2 | 6.86,16.51 C16.2 | 6.86,16.51 7.75,16.51 D1.C | v44.83,5.59 44.83,6.47 B1.2 | v45.59,5.59 45.59,6.6 45.57,6.62 B1.2 | v46.35,5.59 46.35,6.6 46.33,6.62 B1.2
  Bottom 0.6: v0.64,8.76 0.64,0.89 0.92,0.6 48.9,0.6 49.4,1.1 49.4,4.18 48,5.59 v44.83,5.59 | v3.16,9.77 2.16,8.76 v0.64,8.76 | v0.64,8.76 v0.64,16.38 12.56,16.38 v12.7,16.53
  pour Top (no thermals): 4.5,10.81 4.43,10.77 4.36,10.75 2.71,10.75 2.71,10.52 2.9,10.33 5.29,10.33 5.29,12.4 4.62,12.4 4.62,11.01 4.6,10.93 4.56,10.86
VBUS  (via drill 0.2)
  Top 0.2: IC4.8 12.41,6.59 v12.19,6.59 11.56,6.59 R7.1 R8.2
  Top 0.254: v12.7,3.05 13.03,2.72 17.92,2.72 18.49,3.29 IC2.P$33
  Bottom 0.254: v12.7,3.05 12.7,6.08 v12.19,6.59
VIBRATE0  (via drill 0.2)
  Top 0.2: v9.91,11.68 9.65,11.94 Q4.2 | v17.78,8.89 IC2.P$26
  Bottom 0.2: v9.91,11.68 11.43,10.16 15.24,10.16 16.51,8.89 v17.78,8.89
VIBRATE1  (via drill 0.2)
  Top 0.254: Q4.5 9.65,14.96 9.53,15.08 9.53,15.09 v9.38,15.24 | v22.35,9.53 22.99,9.53 23.5,10.04 IC2.P$20
  Bottom 0.254: v9.38,15.24 9.38,13.48 11.18,11.68 21.34,11.68 22.1,10.92 22.1,9.78 v22.35,9.53
VIN
  Top 0.2: Q1.2 4.42,8.89 5.97,8.89 D4.C
  Top 0.6: Q1.2 7.22,8.82 9.22,10.83 15.16,10.83 15.5,11.17 16.16,11.83 16.16,14.47 16.97,15.28 C13.2
  pour Top (rank 2, no thermals): 18.84,14.9 21.04,14.9 21.04,15.57 18.84,15.57

### Text on the board
tPlace: Y | X | Z
bPlace: CC-BY-SA 4.0 / Created by theelims | SmartAss Plug | v0.2 | Code & Instructions: | https://theelims.github.io/SmartAssPlug/ | X | Y | Join the Kinky Makers Discord | Z | https://discord.gg/MmpT9xE | Charge Current / 500 mA | Charging | On/Connect